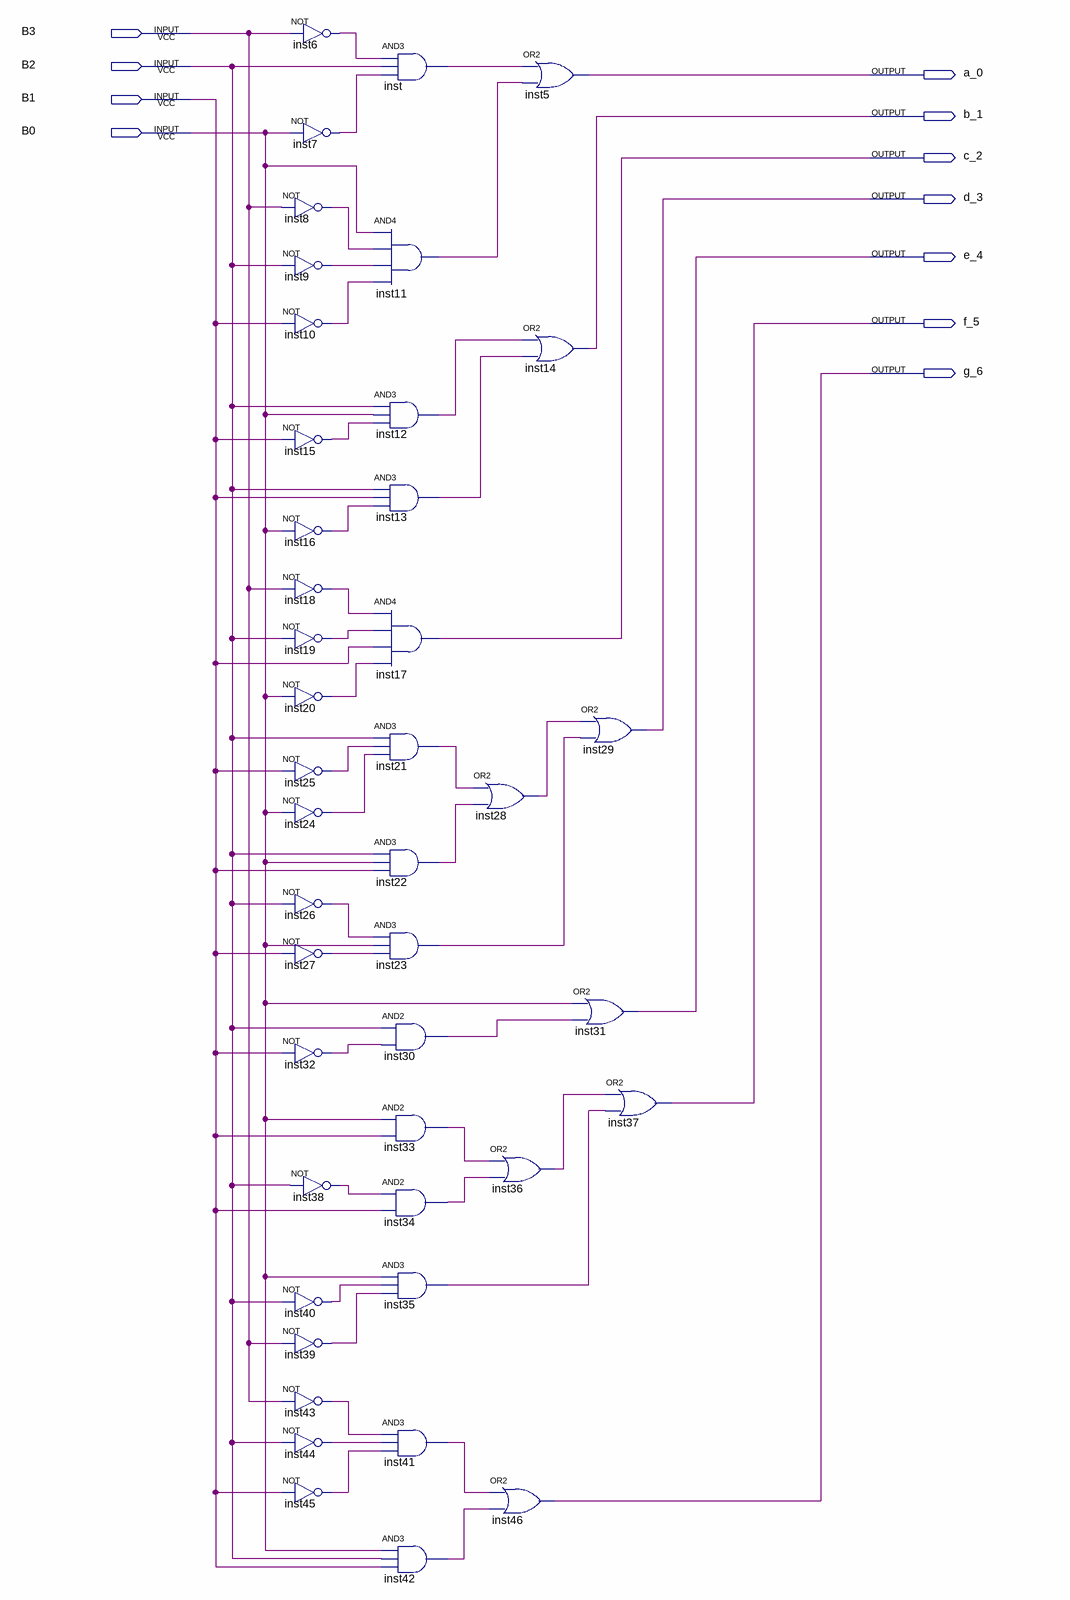
[diagram p0: schematic sheet]
// Quartus schematic display.bdf as structural Verilog: 43 symbols, 11 pins
module display (
  input  B3,
  input  B2,
  input  B1,
  input  B0,
  output a_0,
  output b_1,
  output c_2,
  output d_3,
  output e_4,
  output f_5,
  output g_6
);

  wire inst6_out, inst7_out, inst8_out, inst9_out, inst10_out, inst11_out, inst12_out, inst13_out,
       inst15_out, inst16_out, inst18_out, inst19_out, inst20_out, inst21_out, inst22_out, inst23_out,
       inst24_out, inst25_out, inst26_out, inst27_out, inst28_out, inst30_out, inst32_out, inst33_out,
       inst34_out, inst35_out, inst36_out, inst38_out, inst39_out, inst40_out, inst41_out, inst42_out,
       inst43_out, inst44_out, inst45_out, inst_out;

  not inst6 (inst6_out, B3);
  not inst7 (inst7_out, B0);
  not inst8 (inst8_out, B3);
  not inst9 (inst9_out, B2);
  not inst10 (inst10_out, B1);
  not inst15 (inst15_out, B1);
  not inst16 (inst16_out, B0);
  not inst18 (inst18_out, B3);
  not inst19 (inst19_out, B2);
  not inst20 (inst20_out, B0);
  not inst25 (inst25_out, B1);
  not inst24 (inst24_out, B0);
  not inst26 (inst26_out, B2);
  not inst27 (inst27_out, B1);
  not inst32 (inst32_out, B1);
  not inst38 (inst38_out, B2);
  not inst40 (inst40_out, B2);
  not inst39 (inst39_out, B3);
  not inst43 (inst43_out, B3);
  not inst44 (inst44_out, B2);
  not inst45 (inst45_out, B1);
  and inst (inst_out, inst6_out, B2, inst7_out);
  and inst11 (inst11_out, B0, inst8_out, inst9_out, inst10_out);
  and inst12 (inst12_out, B2, B0, inst15_out);
  and inst13 (inst13_out, B2, B1, inst16_out);
  and inst17 (c_2, inst18_out, inst19_out, B1, inst20_out);
  and inst21 (inst21_out, B2, inst25_out, inst24_out);
  and inst22 (inst22_out, B2, B0, B1);
  and inst23 (inst23_out, inst26_out, B0, inst27_out);
  and inst30 (inst30_out, B2, inst32_out);
  and inst33 (inst33_out, B0, B1);
  and inst34 (inst34_out, inst38_out, B1);
  and inst35 (inst35_out, B0, inst40_out, inst39_out);
  and inst41 (inst41_out, inst43_out, inst44_out, inst45_out);
  and inst42 (inst42_out, B0, B2, B1);
  or inst28 (inst28_out, inst21_out, inst22_out);
  or inst5 (a_0, inst_out, inst11_out);
  or inst14 (b_1, inst12_out, inst13_out);
  or inst36 (inst36_out, inst33_out, inst34_out);
  or inst46 (g_6, inst41_out, inst42_out);
  or inst29 (d_3, inst28_out, inst23_out);
  or inst31 (e_4, B0, inst30_out);
  or inst37 (f_5, inst36_out, inst35_out);
endmodule
